# EAGLE design e-Tapperhandpiece16 (EAGLE 8.2.2)
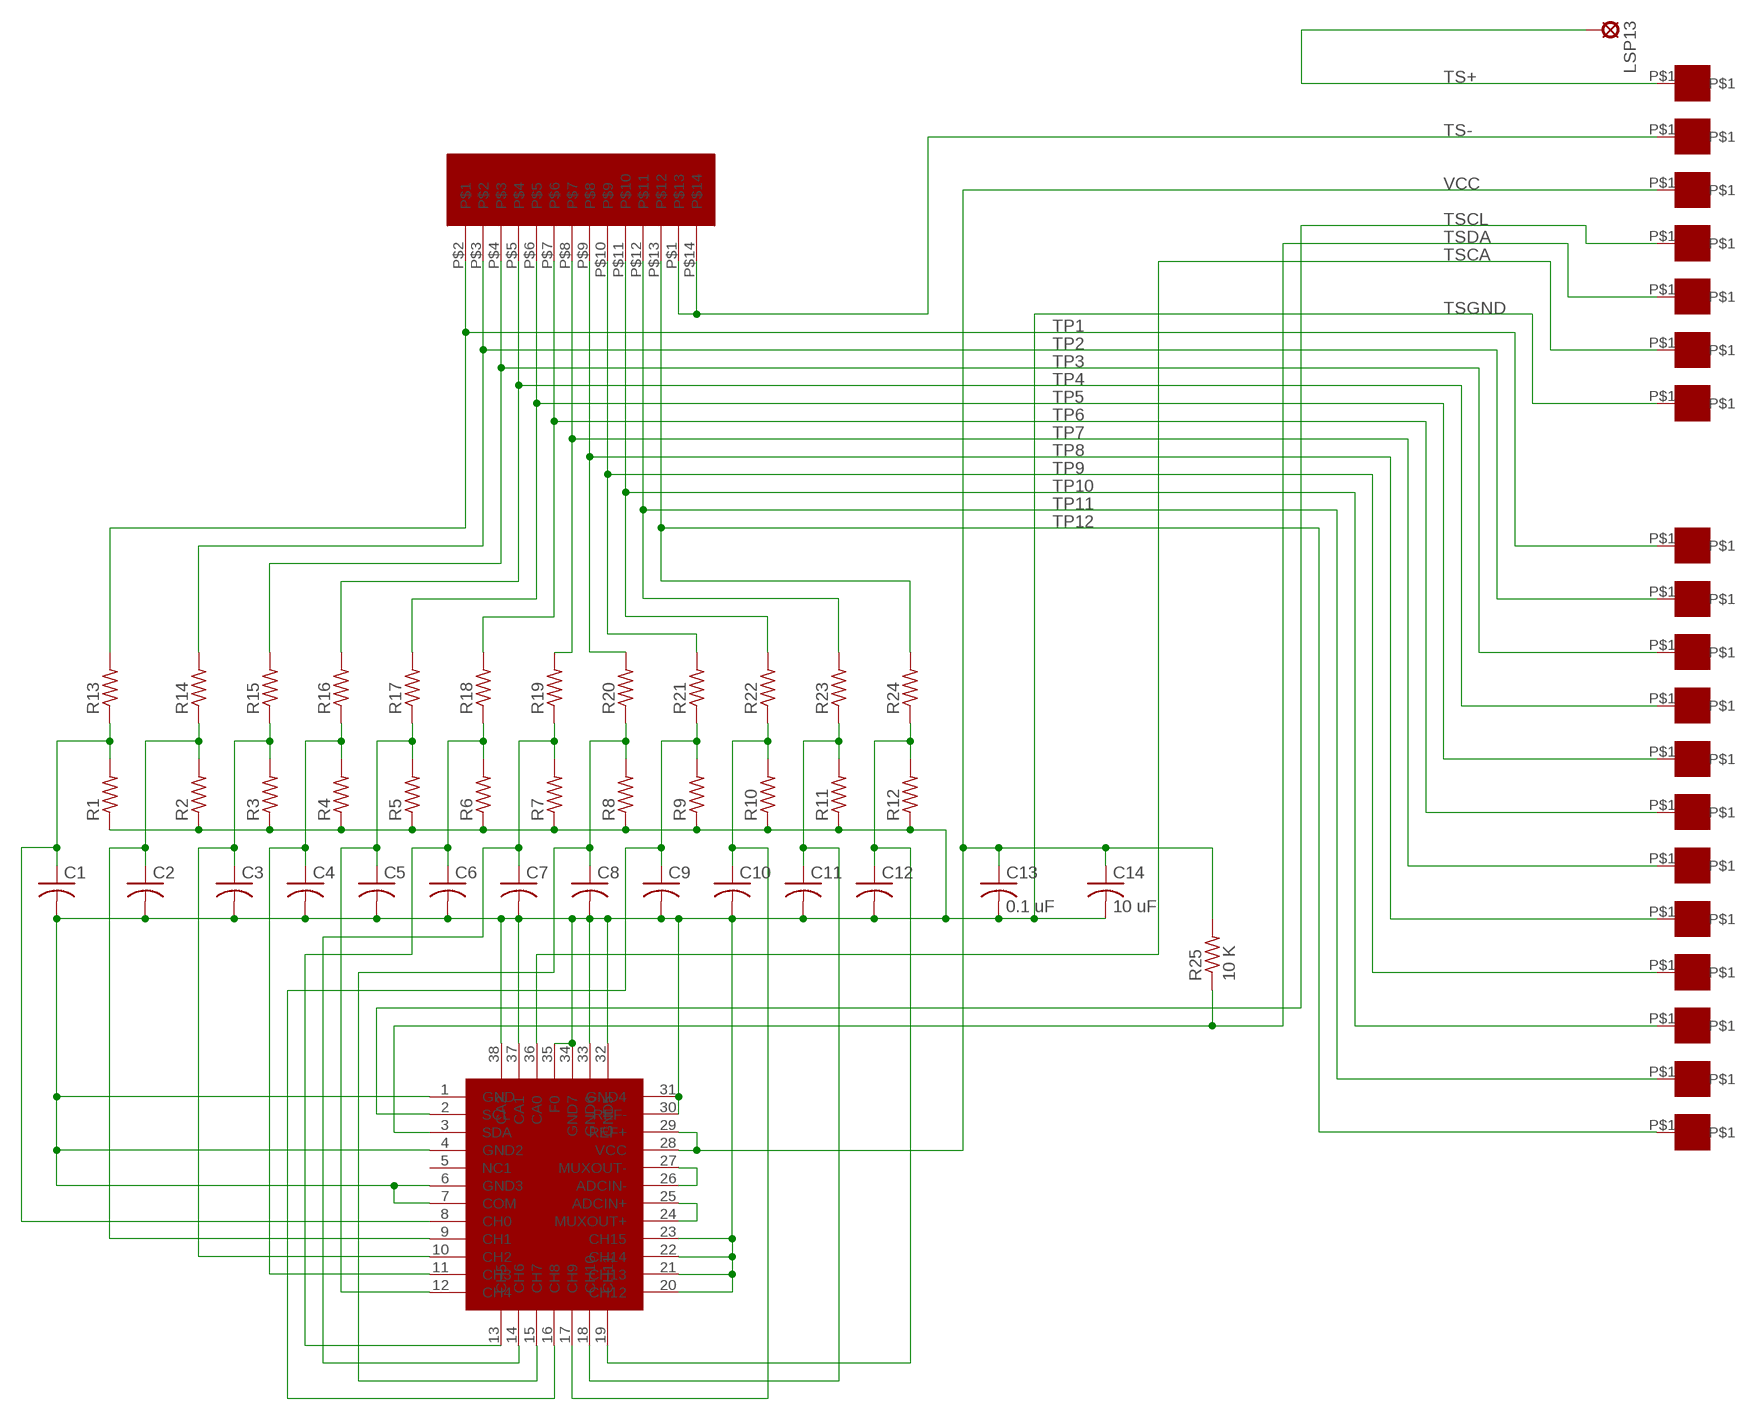
[diagram p0: schematic, sheet 1]

## Parts
C1  C-USC0603  [C0603]
C2  C-USC0603  [C0603]
C3  C-USC0603  [C0603]
C4  C-USC0603  [C0603]
C5  C-USC0603  [C0603]
C6  C-USC0603  [C0603]
C7  C-USC0603  [C0603]
C8  C-USC0603  [C0603]
C9  C-USC0603  [C0603]
C10  C-USC0603  [C0603]
C11  C-USC0603  [C0603]
C12  C-USC0603  [C0603]
C13  0.1 uF  C-USC0603  [C0603]
C14  10 uF  C-USC0805  [C0805]
LSP13  SE11  [SE11]
R1  R-US_R0402  [R0402]
R2  R-US_R0402  [R0402]
R3  R-US_R0402  [R0402]
R4  R-US_R0402  [R0402]
R5  R-US_R0402  [R0402]
R6  R-US_R0402  [R0402]
R7  R-US_R0402  [R0402]
R8  R-US_R0402  [R0402]
R9  R-US_R0402  [R0402]
R10  R-US_R0402  [R0402]
R11  R-US_R0402  [R0402]
R12  R-US_R0402  [R0402]
R13  R-US_R0402  [R0402]
R14  R-US_R0402  [R0402]
R15  R-US_R0402  [R0402]
R16  R-US_R0402  [R0402]
R17  R-US_R0402  [R0402]
R18  R-US_R0402  [R0402]
R19  R-US_R0402  [R0402]
R20  R-US_R0402  [R0402]
R21  R-US_R0402  [R0402]
R22  R-US_R0402  [R0402]
R23  R-US_R0402  [R0402]
R24  R-US_R0402  [R0402]
R25  10 K  R-US_R0402  [R0402]
TSP1  ET1  [ET1]
TSP2  ET1  [ET1]
TSP3  ET1  [ET1]
TSP4  ET1  [ET1]
TSP5  ET1  [ET1]
TSP6  ET1  [ET1]
TSP7  ET1  [ET1]
TSP8  ET1  [ET1]
TSP9  ET1  [ET1]
TSP10  ET1  [ET1]
TSP11  ET1  [ET1]
TSP12  ET1  [ET1]
TSP13  ET1  [ET1]
TSP14  ET1  [ET1]
TSP15  ET1  [ET1]
TSP16  ET1  [ET1]
TSP17  ET1  [ET1]
TSP18  ET1  [ET1]
TSP19  ET1  [ET1]
U$1  LTC2497  [QFN38-5X7]
U$2  SS112D01  [SS112D01]

## Nets
N$1: C9.1 R9.2 R21.1 U$1.16(CH8)
N$2: U$1.26(ADCIN-) U$1.27(MUXOUT-)
N$3: U$1.24(MUXOUT+) U$1.25(ADCIN+)
N$5: C12.1 R12.2 R24.1 U$1.19(CH11)
N$7: C4.1 R4.2 R16.1 U$1.11(CH3)
N$8: C10.1 R10.2 R22.1 U$1.17(CH9)
N$9: C8.1 R8.2 R20.1 U$1.15(CH7)
N$18: C5.1 R5.2 R17.1 U$1.12(CH4)
N$19: C6.1 R6.2 R18.1 U$1.13(CH5)
N$20: C7.1 R7.2 R19.1 U$1.14(CH6)
N$22: C3.1 R3.2 R15.1 U$1.10(CH2)
N$23: C2.1 R2.2 R14.1 U$1.9(CH1)
N$24: C11.1 R11.2 R23.1 U$1.18(CH10)
N$25: C1.1 R1.2 R13.1 U$1.8(CH0)
TP1: R13.2 TSP1.P$1 U$2.P$2
TP2: R14.2 TSP2.P$1 U$2.P$3
TP3: R15.2 TSP3.P$1 U$2.P$4
TP4: R16.2 TSP4.P$1 U$2.P$5
TP5: R17.2 TSP5.P$1 U$2.P$6
TP6: R18.2 TSP6.P$1 U$2.P$7
TP7: R19.2 TSP7.P$1 U$2.P$8
TP8: R20.2 TSP8.P$1 U$2.P$9
TP9: R21.2 TSP9.P$1 U$2.P$10
TP10: R22.2 TSP10.P$1 U$2.P$11
TP11: R23.2 TSP11.P$1 U$2.P$12
TP12: R24.2 TSP12.P$1 U$2.P$13
TS+: LSP13.MP TSP13.P$1
TS-: TSP14.P$1 U$2.P$1 U$2.P$14
TSCA: TSP18.P$1 U$1.36(CA0)
TSCL: TSP16.P$1 U$1.2(SCL)
TSDA: R25.1 TSP17.P$1 U$1.3(SDA)
TSGND: C1.2 C2.2 C3.2 C4.2 C5.2 C6.2 C7.2 C8.2 C9.2 C10.2 C11.2 C12.2 C13.2 C14.2 R1.1 R2.1 R3.1 R4.1 R5.1 R6.1 R7.1 R8.1 R9.1 R10.1 R11.1 R12.1 TSP19.P$1 U$1.1(GND) U$1.4(GND2) U$1.6(GND3) U$1.7(COM) U$1.20(CH12) U$1.21(CH13) U$1.22(CH14) U$1.23(CH15) U$1.30(REF-) U$1.31(GND4) U$1.32(GND5) U$1.33(GND6) U$1.34(GND7) U$1.35(F0) U$1.37(CA1) U$1.38(CA2)
VCC: C13.1 C14.1 R25.2 TSP15.P$1 U$1.28(VCC) U$1.29(REF+)
Unconnected: U$1.5(NC1)

## Library data of the parts
C1-C14 = rcl:C-US: CAPACITOR, American symbol
LSP13 = solpad:SE11: SOLDER PAD RTM, drill 1,1mm, distributor Buerklin, 07F810
R1-R25 = resistor:R-US_: RESISTOR, American symbol
TSP1-TSP19 = ET1:ET1: Through Hold Pads 20 mil drill hole
U$1 = LTC2497:LTC2497: LTC2497 16 Channel ADC with I2C interface
U$2 = SS112D01:SS112D01

## Net classes
0 default: clearance 0.205 mm

## Board
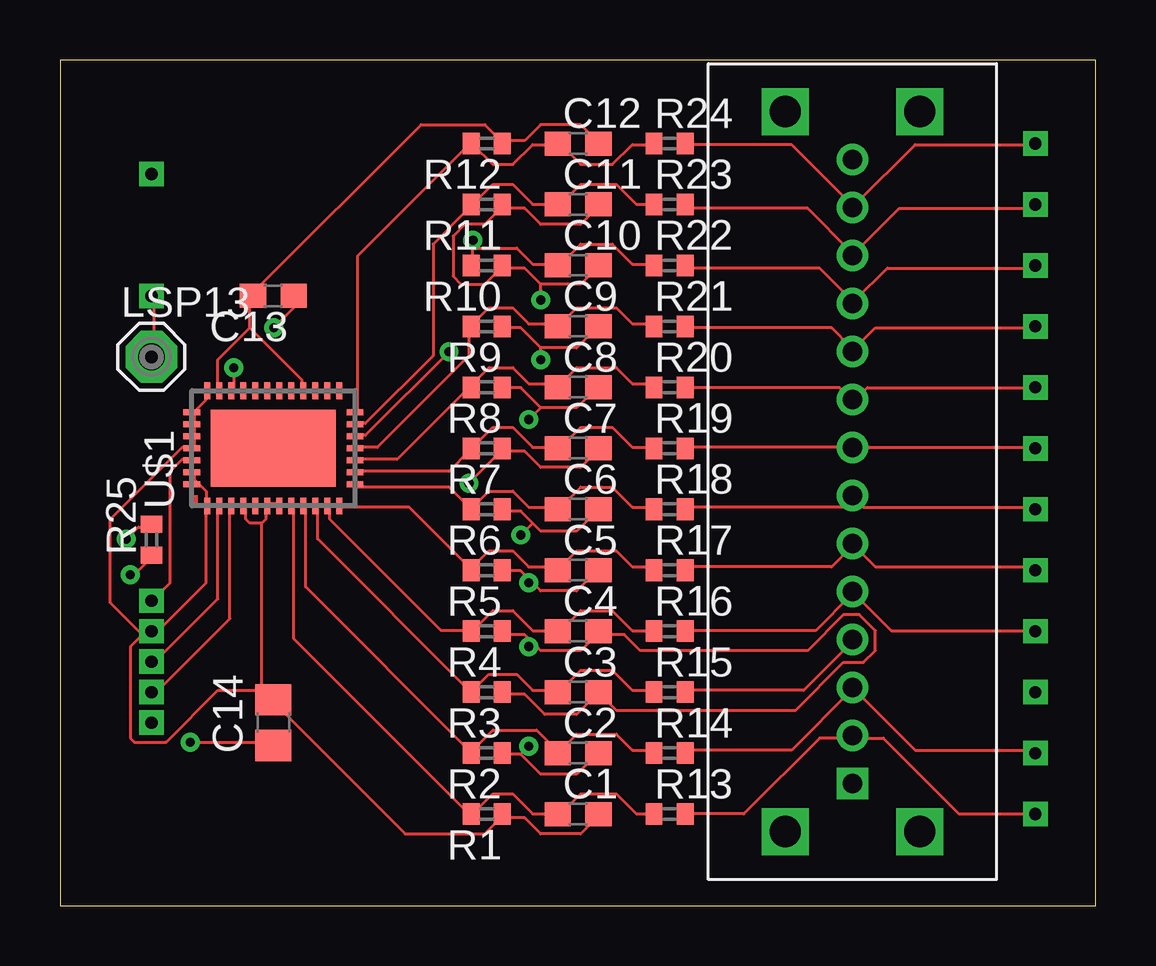
[diagram p1: board, top side]
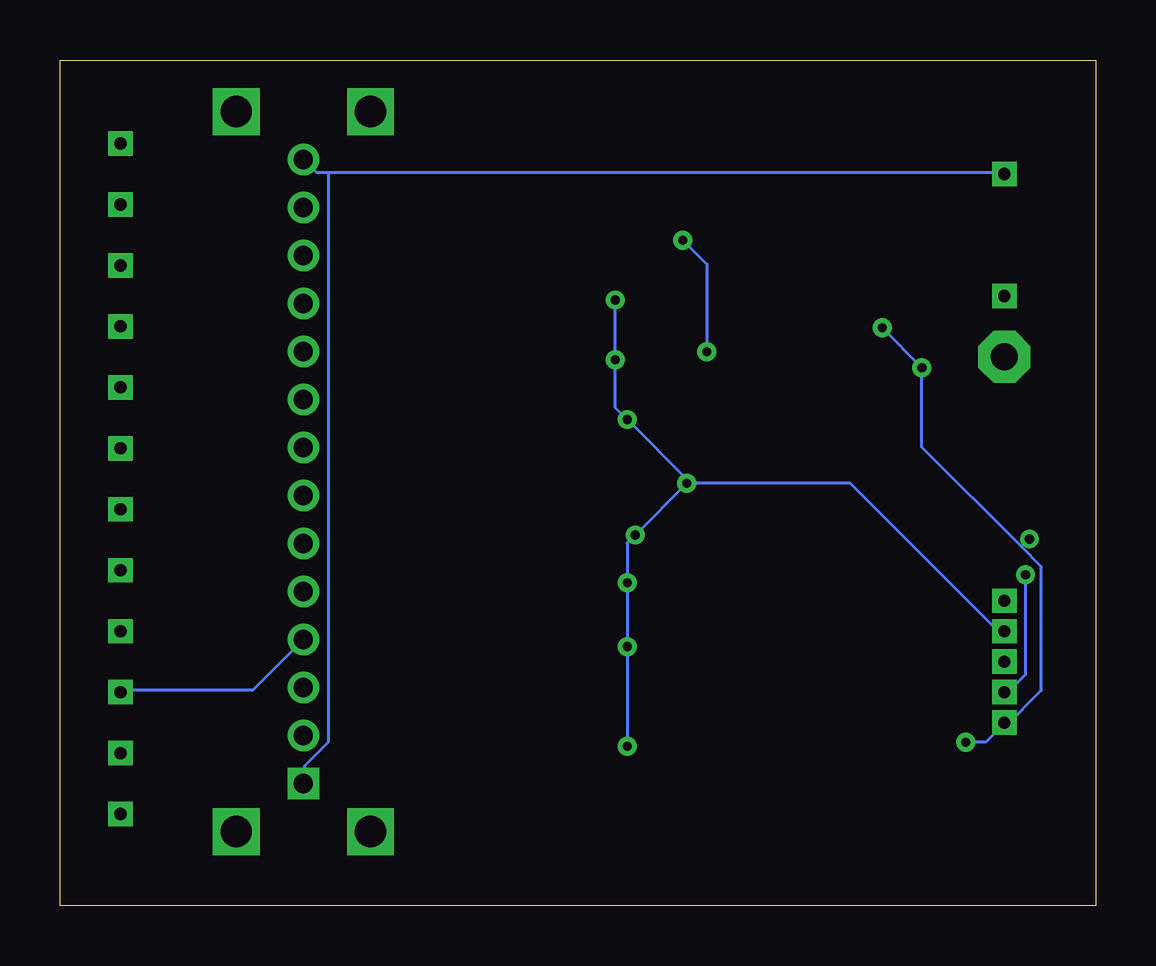
[diagram p2: board, bottom side, seen from below]

Size 43.16 x 35.23 mm. Coordinates in mm from the lower left corner, seen from the top.
Outline: 0,0 43.16,0 43.16,35.23 0,35.23 0,0
Copper layers (1*16): Top 0.035mm / dielectric 1.5mm / Bottom 0.035mm
Design rules "e-tapperhandpiece14": minimum track width 5mil, minimum drill 15mil, track to track 5mil, track to pad 5mil, pad to pad 5mil, via to via 5mil, smd to smd 5mil, copper to edge 5mil, drill to drill 5mil, minimum pad ring 10mil, minimum via ring 8mil, stop-mask expansion 4mil, vias tented up to drill 0mil, thermal gap 10mil

### Footprints (pad centres in the part's own frame; a part is rotated, then mirrored left to right if it is on the bottom)
C0603 = smd 1.1 x 1: 1 -0.85,0; 2 0.85,0
C0805 = smd 1.3 x 1.5: 1 -0.95,0; 2 0.95,0
SE11 = drill 1.118 pad 2.159 octagon: MP 0,0
R0402 = smd 0.7 x 0.9: 1 -0.65,0; 2 0.65,0
ET1 = drill 0.508 square: P$1 0,0
QFN38-5X7 = smd 0.7 x 0.25: 1 -2.4,2.75; 2 -2.4,2.25; 3 -2.4,1.75; 4 -2.4,1.25; 5 -2.4,0.75; 6 -2.4,0.25; 7 -2.4,-0.25; 8 -2.4,-0.75; 9 -2.4,-1.25; 10 -2.4,-1.75; 11 -2.4,-2.25; 12 -2.4,-2.75; 20 2.4,-2.75; 21 2.4,-2.25; 22 2.4,-1.75; 23 2.4,-1.25; 24 2.4,-0.75; 25 2.4,-0.25; 26 2.4,0.25; 27 2.4,0.75; 28 2.4,1.25; 29 2.4,1.75; 30 2.4,2.25; 31 2.4,2.75 | smd 0.25 x 0.7: 13 -1.5,-3.4; 14 -1,-3.4; 15 -0.5,-3.4; 16 0,-3.4; 17 0.5,-3.4; 18 1,-3.4; 19 1.5,-3.4; 32 1.5,3.4; 33 1,3.4; 34 0.5,3.4; 35 0,3.4; 36 -0.5,3.4; 37 -1,3.4; 38 -1.5,3.4 | smd 3.2 x 5.2: EXP 0,0
SS112D01 = drill 0.8 square: P$1 6.35,3.81 | drill 0.8: P$2 6.35,5.81; P$3 6.35,7.81; P$4 6.35,9.81; P$5 6.35,11.81; P$6 6.35,13.81; P$7 6.35,15.81; P$8 6.35,17.81; P$9 6.35,19.81; P$10 6.35,21.81; P$11 6.35,23.81; P$12 6.35,25.81; P$13 6.35,27.81; P$14 6.35,29.81 | drill 1.3 square: P$15 9.15,31.81; P$16 3.55,31.81; P$17 9.15,1.81; P$18 3.55,1.81

### Placement (x,y rotation side)
C1  21.59,3.81 0 top
C2  21.59,6.35 0 top
C3  21.59,8.89 0 top
C4  21.59,11.43 0 top
C5  21.59,13.97 0 top
C6  21.59,16.51 0 top
C7  21.59,19.05 0 top
C8  21.59,21.59 0 top
C9  21.59,24.13 0 top
C10  21.59,26.67 0 top
C11  21.59,29.21 0 top
C12  21.59,31.75 0 top
C13  8.89,25.4 180 top
C14  8.89,7.62 90 top
LSP13  3.81,22.86 0 top
R1  17.78,3.81 180 top
R2  17.78,6.35 180 top
R3  17.78,8.89 180 top
R4  17.78,11.43 180 top
R5  17.78,13.97 180 top
R6  17.78,16.51 180 top
R7  17.78,19.05 180 top
R8  17.78,21.59 180 top
R9  17.78,24.13 180 top
R10  17.78,26.67 180 top
R11  17.78,29.21 180 top
R12  17.78,31.75 180 top
R13  25.4,3.81 0 top
R14  25.4,6.35 0 top
R15  25.4,8.89 0 top
R16  25.4,11.43 0 top
R17  25.4,13.97 0 top
R18  25.4,16.51 0 top
R19  25.4,19.05 0 top
R20  25.4,21.59 0 top
R21  25.4,24.13 0 top
R22  25.4,26.67 0 top
R23  25.4,29.21 0 top
R24  25.4,31.75 0 top
R25  3.81,15.24 90 top
TSP1  40.64,3.81 0 top
TSP2  40.64,6.35 0 top
TSP3  40.64,8.89 0 top
TSP4  40.64,11.43 0 top
TSP5  40.64,13.97 0 top
TSP6  40.64,16.51 0 top
TSP7  40.64,19.05 0 top
TSP8  40.64,21.59 0 top
TSP9  40.64,24.13 0 top
TSP10  40.64,26.67 0 top
TSP11  40.64,29.21 0 top
TSP12  40.64,31.75 0 top
TSP13  3.81,25.4 0 top
TSP14  3.81,30.48 0 top
TSP15  3.81,7.62 0 top
TSP16  3.81,10.16 0 top
TSP17  3.81,8.89 0 top
TSP18  3.81,12.7 0 top
TSP19  3.81,11.43 90 top
U$1  8.89,19.05 90 top
U$2  26.67,1.27 0 top

### Tracks (layer width: path | path; a pad name or v marks a point on that pad's centre or on a via)
N$1
  Top 0.127: R21.1 24.68,24.24 23.85,24.24 23.18,24.9 21.52,24.9 20.86,24.24 C9.1 20.69,24.24 19.53,24.24 18.87,24.9 17.87,24.9 17.21,24.24 R9.2 17.04,24.07 17.04,22.91 13.22,19.09 12.39,19.09 U$1.16
N$2
  Top 0.127: U$1.27 8.24,21.41 8.57,21.41 U$1.26
N$3
  Top 0.127: U$1.25 9.24,21.41 9.57,21.41 U$1.24
N$5
  Top 0.127: R24.1 24.68,31.71 23.85,31.71 23.02,30.88 21.69,30.88 20.86,31.71 C12.1 20.69,31.71 19.7,31.71 18.87,30.88 18.04,30.88 17.21,31.71 R12.2 17.04,31.71 12.39,27.06 12.39,20.58 U$1.19
N$7
  Top 0.127: R16.1 24.68,11.45 23.85,11.45 23.02,12.28 21.69,12.28 20.86,11.45 C4.1 20.69,11.45 19.7,11.45 18.87,12.28 18.04,12.28 17.21,11.45 R4.2 17.04,11.45 15.88,11.45 11.23,16.1 11.23,16.6 U$1.11
N$8  (via drill 0.38)
  Top 0.127: R22.1 24.68,26.73 23.85,26.73 23.02,27.56 21.69,27.56 20.86,26.73 C10.1 20.69,26.73 19.7,26.73 19.03,27.39 17.21,27.39 | v16.21,23.07 12.72,19.59 12.39,19.59 U$1.17 | 17.21,27.39 17.21,26.73 R10.2 | 17.21,27.39 v17.21,27.72
  Bottom 0.127: v16.21,23.07 16.21,26.73 v17.21,27.72
N$9
  Top 0.127: R20.1 24.68,21.75 23.85,21.75 23.18,22.41 21.52,22.41 20.86,21.75 C8.1 20.69,21.75 19.53,21.75 18.87,22.41 17.87,22.41 17.21,21.75 R8.2 17.04,21.58 14.05,18.59 12.39,18.59 U$1.15
N$18
  Top 0.127: R17.1 24.68,14.11 23.85,14.11 23.18,14.77 21.52,14.77 20.86,14.11 C5.1 20.69,14.11 19.53,14.11 18.87,14.77 17.87,14.77 17.21,14.11 R5.2 17.04,14.11 14.55,16.6 11.73,16.6 U$1.12
N$19
  Top 0.127: R18.1 24.68,16.6 23.85,16.6 23.02,17.43 21.69,17.43 20.86,16.6 C6.1 20.69,16.6 19.53,16.6 18.87,17.26 17.87,17.26 17.21,16.6 R6.2 16.21,17.43 12.39,17.43 U$1.13
N$20
  Top 0.127: R19.1 24.68,19.09 23.85,19.09 23.02,19.92 21.69,19.92 20.86,19.09 C7.1 20.69,19.09 19.7,19.09 18.87,19.92 18.04,19.92 17.21,19.09 R7.2 17.04,18.92 16.21,18.09 12.39,18.09 U$1.14
N$22
  Top 0.127: R15.1 24.68,8.96 23.85,8.96 23.02,9.79 21.69,9.79 20.86,8.96 C3.1 20.69,8.96 19.7,8.96 19.03,9.63 17.87,9.63 17.21,8.96 R3.2 17.04,8.96 10.73,15.27 10.73,16.6 U$1.10
N$23
  Top 0.127: R14.1 24.68,6.47 23.85,6.47 23.18,7.14 21.52,7.14 20.86,6.47 C2.1 20.69,6.47 19.86,7.3 18.04,7.3 17.21,6.47 R2.2 17.04,6.47 10.23,13.28 10.23,16.6 U$1.9
N$24
  Top 0.127: R23.1 24.68,29.22 24.01,29.22 23.18,30.05 21.69,30.05 20.86,29.22 C11.1 20.69,29.22 19.7,29.22 18.87,30.05 18.04,30.05 17.21,29.22 R11.2 17.04,29.05 15.55,27.56 15.55,22.91 12.72,20.09 12.39,20.09 U$1.18
N$25
  Top 0.127: R13.1 24.68,3.82 24.01,3.82 23.18,4.65 21.69,4.65 20.86,3.82 C1.1 20.69,3.82 19.7,3.82 18.87,4.65 18.04,4.65 17.21,3.82 R1.2 17.04,3.82 9.74,11.12 9.74,16.6 U$1.8
TP1
  Top 0.127: R13.2 26.17,3.82 28.49,3.82 31.65,6.97 32.98,6.97 U$2.P$2 33.14,6.97 34.3,6.97 37.46,3.82 40.61,3.82 TSP1.P$1
TP2
  Top 0.127: R14.2 26.17,6.47 30.49,6.47 32.98,8.96 U$2.P$3 33.14,8.96 35.63,6.47 40.61,6.47 TSP2.P$1
TP3
  Top 0.127: R15.2 26.17,8.96 30.98,8.96 32.98,10.96 U$2.P$4
  Bottom 0.127: TSP3.P$1 40.61,8.96 35.13,8.96 33.14,10.96 U$2.P$4
TP4
  Top 0.127: R16.2 26.17,11.45 31.48,11.45 32.98,12.95 U$2.P$5 33.14,12.95 34.64,11.45 40.61,11.45 TSP4.P$1
TP5
  Top 0.127: R17.2 26.17,14.11 32.15,14.11 32.98,14.94 U$2.P$6 33.14,14.94 33.97,14.11 40.61,14.11 TSP5.P$1
TP6
  Top 0.127: R18.2 26.17,16.6 32.64,16.6 32.98,16.93 U$2.P$7 33.14,16.93 33.47,16.6 40.61,16.6 TSP6.P$1
TP7
  Top 0.127: R19.2 26.17,19.09 32.98,19.09 U$2.P$8 33.14,19.09 40.61,19.09 TSP7.P$1
TP8
  Top 0.127: R20.2 26.17,21.58 32.48,21.58 32.98,21.08 U$2.P$9 33.14,21.08 33.64,21.58 40.61,21.58 TSP8.P$1
TP9
  Top 0.127: R21.2 26.17,24.07 32.15,24.07 32.98,23.24 U$2.P$10 33.14,23.24 33.97,24.07 40.61,24.07 TSP9.P$1
TP10
  Top 0.127: R22.2 26.17,26.56 31.65,26.56 32.98,25.23 U$2.P$11 33.14,25.23 34.47,26.56 40.61,26.56 TSP10.P$1
TP11
  Top 0.127: R23.2 26.17,29.05 31.15,29.05 32.98,27.22 U$2.P$12 33.14,27.22 34.97,29.05 40.61,29.05 TSP11.P$1
TP12
  Top 0.127: R24.2 26.17,31.71 30.49,31.71 32.98,29.22 U$2.P$13 33.14,29.22 35.63,31.71 40.61,31.71 TSP12.P$1
TS+
  Top 0.127: TSP13.P$1 3.93,25.4 3.93,22.91 LSP13.MP
TS-
  Bottom 0.127: 31.98,30.54 32.48,30.54 32.98,31.04 U$2.P$14 | 31.98,30.54 3.93,30.54 TSP14.P$1 | 31.98,30.54 31.98,6.81 32.98,5.81 32.98,5.15 U$2.P$1
TSCA
  Top 0.127: U$1.36 5.42,18.59 5.09,18.59 4.59,18.09 4.59,13.45 3.93,12.78 TSP18.P$1
TSCL
  Top 0.127: U$1.2 6.58,16.6 6.58,12.78 3.93,10.13 TSP16.P$1
TSDA  (via drill 0.38)
  Top 0.127: U$1.3 7.08,16.6 7.08,11.95 3.93,8.8 TSP17.P$1 | v2.93,13.78 3.1,13.78 3.76,14.44 R25.1
  Bottom 0.127: v2.93,13.78 2.93,9.63 3.76,8.8 TSP17.P$1
TSGND  (via drill 0.38)
  Top 0.127: C12.2 22.35,31.87 21.69,32.54 20.03,32.54 19.36,31.87 18.53,31.87 R12.1 18.37,31.87 17.7,32.54 15.05,32.54 8.08,25.56 C13.2 7.91,25.4 7.91,24.07 | U$1.20 11.56,21.41 11.23,21.41 U$1.21 11.06,21.41 10.73,21.41 U$1.22 10.57,21.41 10.23,21.41 U$1.23 10.07,21.58 10.07,21.91 7.91,24.07 | 5.59,19.59 5.59,19.09 U$1.35 5.42,19.09 5.09,19.09 2.1,16.1 2.1,12.62 3.43,11.29 | 5.59,20.58 5.59,20.09 | 5.59,20.09 5.59,19.59 | 5.59,19.59 U$1.34 | 5.59,20.09 U$1.33 | 5.59,20.58 6.08,21.08 6.08,21.41 U$1.31 6.25,21.41 6.58,21.41 U$1.30 6.58,21.58 6.58,22.74 7.91,24.07 | 5.59,20.58 U$1.32 | C1.2 22.35,3.65 21.69,2.99 20.03,2.99 19.36,3.65 18.53,3.65 R1.1 18.37,3.65 17.7,2.99 14.38,2.99 8.91,8.47 C14.2 | 8.41,15.94 7.91,15.94 7.74,16.1 7.74,16.6 U$1.4 | 8.41,15.94 8.57,16.1 8.57,16.6 U$1.6 8.74,16.77 9.07,16.77 U$1.7 | 8.41,8.96 8.41,15.94 | 8.41,8.96 8.74,8.63 C14.2 | 19.7,10.96 20.03,10.62 21.69,10.62 22.35,11.29 C4.2 22.52,11.29 23.51,11.29 24.18,10.62 31.15,10.62 32.64,12.12 33.31,12.12 33.97,11.45 33.97,10.62 33.47,10.13 32.64,10.13 30.65,8.13 23.18,8.13 22.52,8.8 C3.2 22.35,8.8 21.52,7.97 20.19,7.97 19.36,8.8 18.53,8.8 R3.1 | 19.7,10.96 19.36,11.29 18.53,11.29 R4.1 | 20.03,25.9 19.36,26.56 18.53,26.56 R10.1 18.37,26.56 17.7,25.9 16.71,25.9 16.38,26.23 16.38,27.89 16.87,28.39 17.7,28.39 18.37,29.05 R11.1 18.53,29.05 19.36,29.05 20.03,28.39 21.69,28.39 22.35,29.05 C11.2 | 20.03,25.9 21.69,25.9 22.35,26.56 C10.2 | 19.7,15.94 20.03,15.6 21.52,15.6 22.35,16.43 C6.2 | 19.7,15.94 19.2,16.43 18.53,16.43 R6.1 | 20.03,23.24 19.2,24.07 18.53,24.07 R9.1 | 20.03,23.24 21.52,23.24 22.35,24.07 C9.2
  Top 0.127: 19.2,6.31 18.53,6.31 R2.1 | 19.2,6.31 20.03,5.48 21.52,5.48 22.35,6.31 C2.2 | 19.53,13.61 20.03,13.11 21.52,13.11 22.35,13.94 C5.2 | 19.53,13.61 19.2,13.94 18.53,13.94 R5.1 | 20.03,20.75 19.2,21.58 18.53,21.58 R8.1 | 20.03,20.75 21.52,20.75 22.35,21.58 C8.2 | C7.2 22.35,18.92 21.69,18.26 20.03,18.26 19.36,18.92 18.53,18.92 R7.1 18.37,18.92 v17.04,17.6 | 5.59,17.76 5.59,17.93 U$1.37 | 5.59,17.76 5.59,17.6 U$1.38 | 5.59,17.76 6.08,17.26 6.08,16.77 U$1.1 6.08,16.6 6.08,13.45 3.93,11.29 TSP19.P$1 | v19.53,20.25 20.03,20.75 | v19.53,13.45 19.53,13.61 | v19.53,6.64 19.2,6.31 | v20.03,22.74 20.03,23.24 | v19.2,15.44 19.7,15.94 | v20.03,25.23 20.03,25.9 | v19.53,10.79 19.7,10.96 | 8.41,8.96 6.58,8.96 4.42,6.81 3.1,6.81 2.93,6.97 2.93,10.79 3.43,11.29 | 3.43,11.29 3.76,11.29 TSP19.P$1 | 8.41,8.96 C14.2 | 3.43,11.29 TSP19.P$1
  Bottom 0.127: 16.87,17.6 10.23,17.6 3.93,11.29 TSP19.P$1 | 16.87,17.6 v19.53,20.25 20.03,20.75 v20.03,22.74 v20.03,25.23 | 16.87,17.6 v17.04,17.6 v19.2,15.44 19.53,15.11 v19.53,13.45 v19.53,10.79 v19.53,6.64
VCC  (via drill 0.38)
  Top 0.127: U$1.28 7.58,21.41 7.25,21.41 U$1.29 7.25,21.58 v7.25,22.41 | v2.76,15.27 3.26,15.77 3.76,15.77 R25.2 | v8.91,24.07 9.74,24.9 C13.1 | v5.42,6.81 8.74,6.81 C14.1
  Bottom 0.127: 3.1,14.94 2.27,14.11 2.27,8.96 3.76,7.47 TSP15.P$1 3.93,7.47 4.59,6.81 v5.42,6.81 | 3.1,14.94 7.25,19.09 v7.25,22.41 v8.91,24.07 | 3.1,14.94 v2.76,15.27